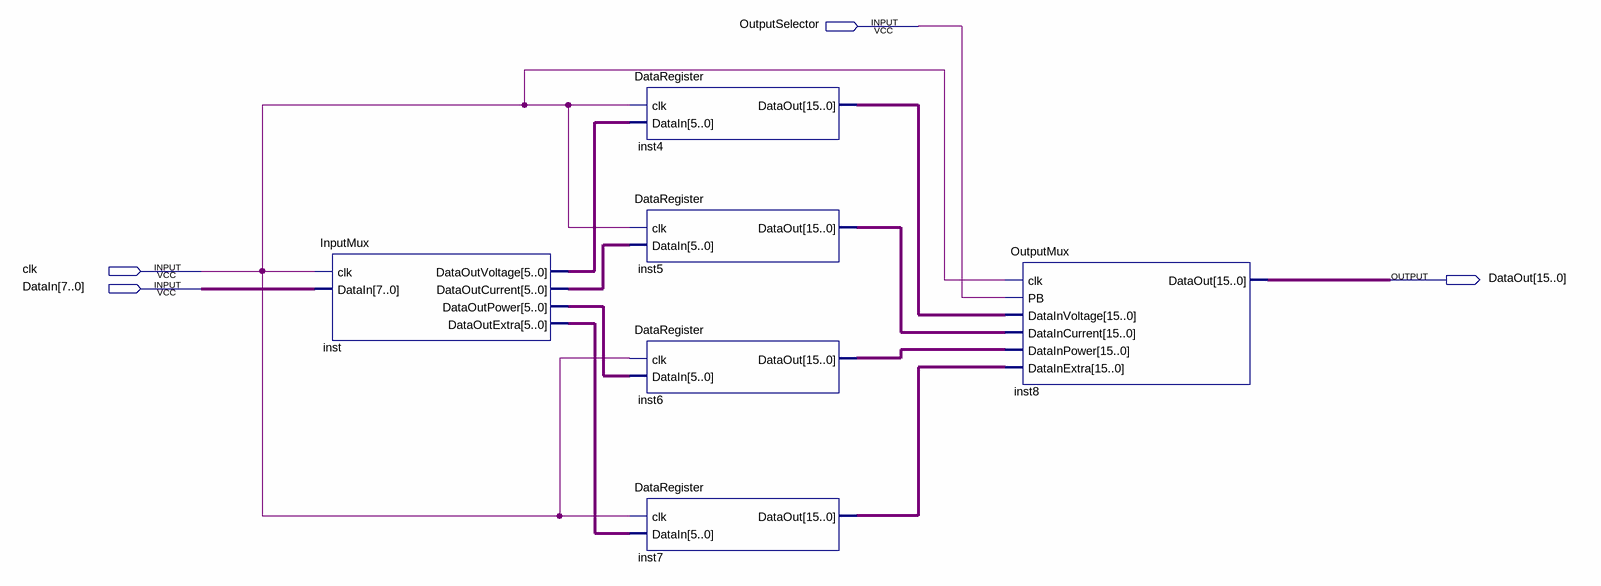
[diagram p0: schematic sheet]
// Quartus schematic mux_test.bdf as structural Verilog: 6 symbols, 4 pins
module mux_test (
  input  OutputSelector,
  input  clk,
  input  [7:0] DataIn,
  output [15:0] DataOut
);

  wire [5:0] inst_dataoutcurrent, inst_dataoutextra, inst_dataoutpower, inst_dataoutvoltage;
  wire [15:0] inst4_dataout, inst5_dataout, inst6_dataout, inst7_dataout;

  InputMux inst (
    .clk(clk), .DataIn(DataIn), .DataOutVoltage(inst_dataoutvoltage), .DataOutCurrent(inst_dataoutcurrent),
    .DataOutPower(inst_dataoutpower), .DataOutExtra(inst_dataoutextra));
  DataRegister inst4 (.clk(clk), .DataIn(inst_dataoutvoltage), .DataOut(inst4_dataout));
  DataRegister inst5 (.clk(clk), .DataIn(inst_dataoutcurrent), .DataOut(inst5_dataout));
  DataRegister inst6 (.clk(clk), .DataIn(inst_dataoutpower), .DataOut(inst6_dataout));
  DataRegister inst7 (.clk(clk), .DataIn(inst_dataoutextra), .DataOut(inst7_dataout));
  OutputMux inst8 (
    .clk(clk), .PB(OutputSelector), .DataInVoltage(inst4_dataout), .DataInCurrent(inst5_dataout),
    .DataInPower(inst6_dataout), .DataInExtra(inst7_dataout), .DataOut(DataOut));
endmodule
